# Altium schematic sheet 01 COVER PAGE.SchDoc: COVER PAGE
size 420 x 297 mm; SheetNumber: 1; SheetTotal: 8
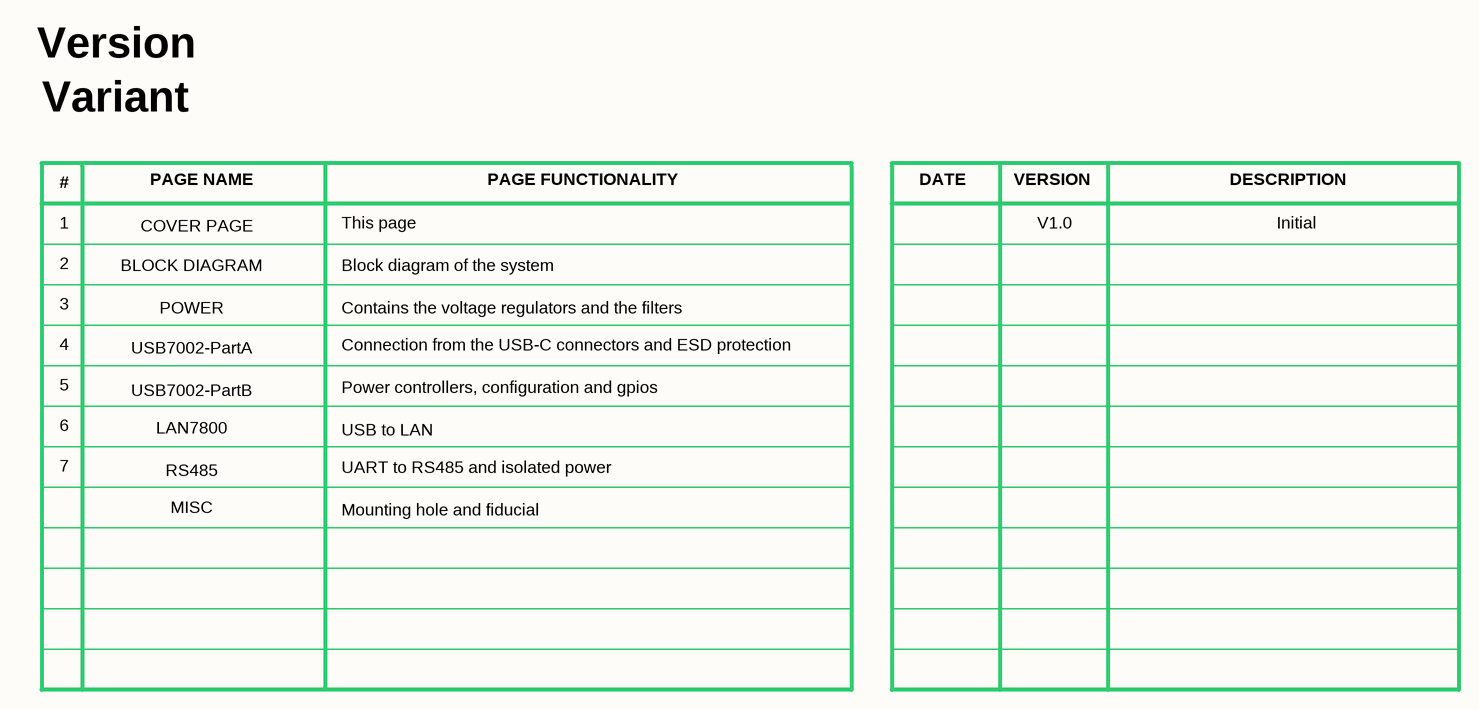
[diagram p0: 01 COVER PAGE.SchDoc]

## Notes on the sheet
- Version
- Variant
- #
- 1
- PAGE NAME
- COVER PAGE
- This page
- PAGE FUNCTIONALITY
- DATE
- VERSION
- V1.0
- DESCRIPTION
- Initial
- 2
- POWER
- BLOCK DIAGRAM
- Contains the voltage regulators and the filters
- Block diagram of the system
- 3
- 4
- USB7002-PartA
- Connection from the USB-C connectors and ESD protection
- 5
- 6
- USB7002-PartB
- LAN7800
- Power controllers, configuration and gpios
- USB to LAN
- 7
- RS485
- MISC
- UART to RS485 and isolated power
- Mounting hole and fiducial
- Title
- Project
- Size
- Date
- Revision
- A3
- Designed By